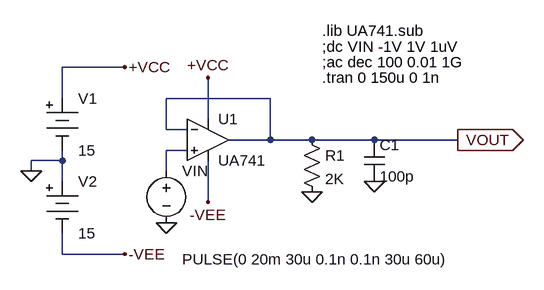
[diagram p0: schematic UA741_tran.asc]
UA741_tran.asc, the LTspice schematic file:
Version 4
SHEET 1 880 680
WIRE 48 32 -48 32
WIRE -48 80 -48 32
WIRE 272 80 112 80
WIRE 176 112 176 48
WIRE 112 128 112 80
WIRE 144 128 112 128
WIRE 272 144 272 80
WIRE 272 144 208 144
WIRE 336 144 272 144
WIRE 432 144 336 144
WIRE 560 144 432 144
WIRE 144 160 112 160
WIRE -48 176 -48 160
WIRE -48 176 -96 176
WIRE -96 192 -96 176
WIRE 112 192 112 160
WIRE -48 208 -48 176
WIRE 176 240 176 176
WIRE -48 320 -48 288
WIRE 48 320 -48 320
FLAG -96 192 0
FLAG 336 224 0
FLAG 48 32 +VCC
FLAG 176 48 +VCC
FLAG 48 320 -VEE
FLAG 176 240 -VEE
FLAG 112 272 0
FLAG 560 144 VOUT
IOPIN 560 144 Out
FLAG 432 208 0
SYMBOL Opamps\\opamp2 176 80 R0
SYMATTR InstName U1
SYMATTR Value UA741
SYMBOL res 320 128 R0
SYMATTR InstName R1
SYMATTR Value 2K
SYMBOL Misc\\battery -48 64 R0
WINDOW 123 0 0 Left 2
WINDOW 39 0 0 Left 2
SYMATTR InstName V1
SYMATTR Value 15
SYMBOL Misc\\battery -48 192 R0
WINDOW 123 0 0 Left 2
WINDOW 39 0 0 Left 2
SYMATTR InstName V2
SYMATTR Value 15
SYMBOL voltage 112 176 R0
WINDOW 3 24 152 Left 2
WINDOW 123 24 124 Left 2
WINDOW 39 0 0 Left 2
SYMATTR InstName VIN
SYMATTR Value PULSE(0 20m 30u 0.1n 0.1n 30u 60u)
SYMBOL cap 416 144 R0
SYMATTR InstName C1
SYMATTR Value 100p
TEXT 352 -24 Left 2 !.lib UA741.sub
TEXT 352 0 Left 2 !;dc VIN -1V 1V 1uV
TEXT 352 24 Left 2 !;ac dec 100 0.01 1G
TEXT 352 48 Left 2 !.tran 0 150u 0 1n

The netlist it stands for:
* UA741_tran.asc
XU1 N001 VOUT +VCC -VEE VOUT UA741  ; pins In+ In- V+ V- OUT
R1 VOUT 0 2K
V1 +VCC 0 15
V2 0 -VEE 15
VIN N001 0 PULSE(0 20m 30u 0.1n 0.1n 30u 60u)
C1 VOUT 0 100p
.lib UA741.sub
;dc VIN -1V 1V 1uV
;ac dec 100 0.01 1G
.tran 0 150u 0 1n
.backanno
.end

* Results of the author's LTspice run, read from the files saved beside the schematic
* Operating Point, zero values left out:
*   V(vout) = 11.18 µV
*   V(-vee) = -15 V
*   V(+vcc) = 15 V
*   I(R1) = 5.592 nA
*   I(Vin) = -79.74 nA
*   I(V2) = -1.667 mA
*   I(V1) = -1.667 mA
*   Ix(u1:1) = 79.74 nA
*   Ix(u1:2) = 79.76 nA
*   Ix(u1:3) = 1.667 mA
*   Ix(u1:4) = -1.667 mA
*   Ix(u1:5) = -85.35 nA